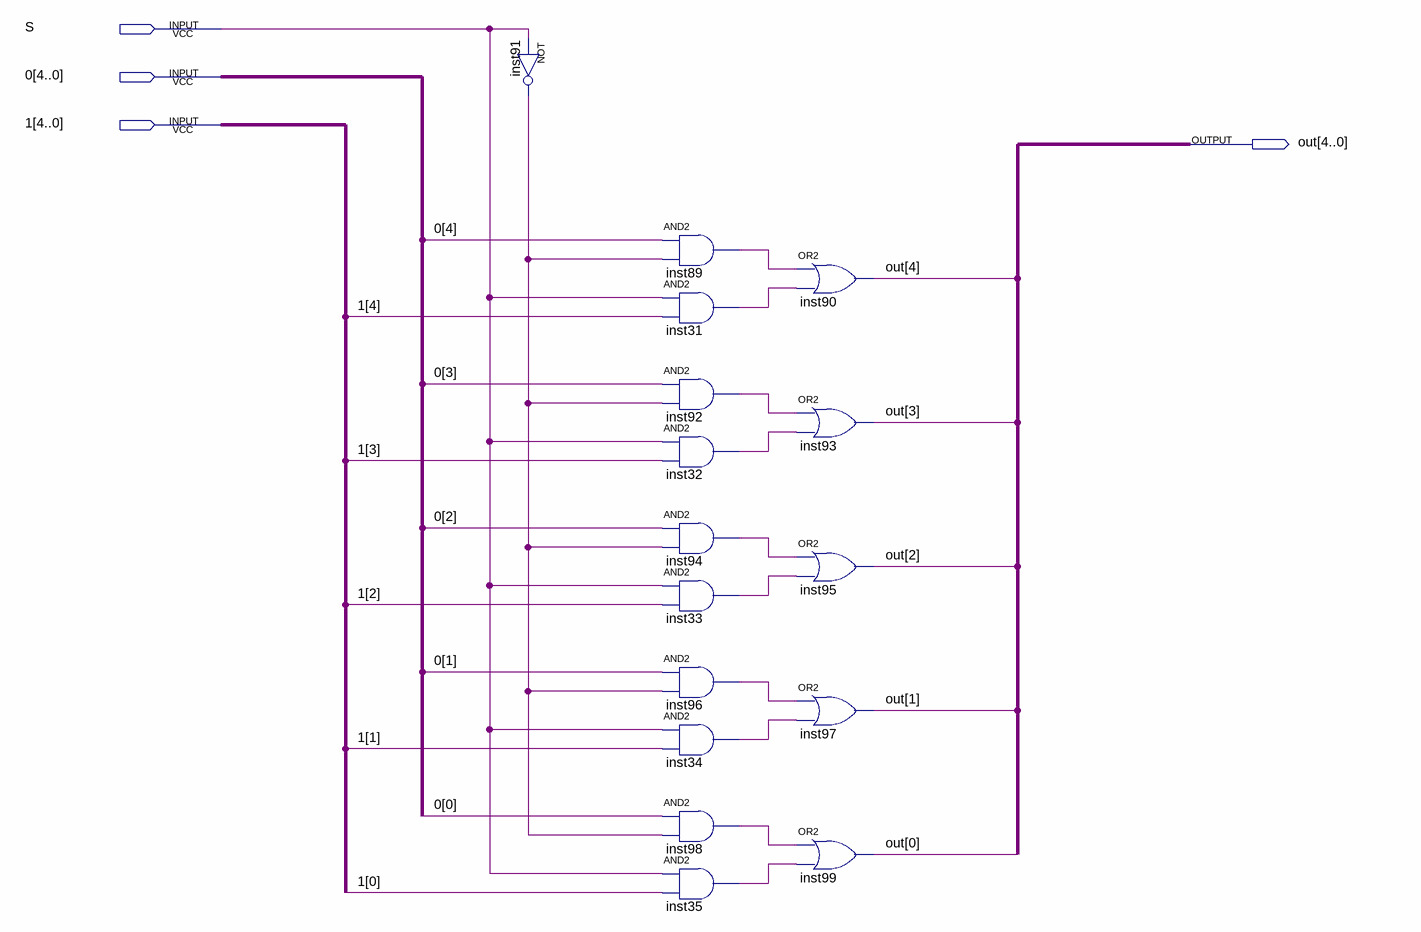
[diagram p0: schematic sheet]
// Quartus schematic Mux_2_5bits.bdf as structural Verilog: 16 symbols, 4 pins
module Mux_2_5bits (
  input  S,
  input  [4:0] \0 ,
  input  [4:0] \1 ,
  output [4:0] out
);

  wire inst31_out, inst32_out, inst33_out, inst34_out, inst35_out, inst89_out, inst91_out, inst92_out,
       inst94_out, inst96_out, inst98_out;

  not inst91 (inst91_out, S);
  and inst89 (inst89_out, \0 [4], inst91_out);
  and inst31 (inst31_out, S, \1 [4]);
  and inst92 (inst92_out, \0 [3], inst91_out);
  and inst32 (inst32_out, S, \1 [3]);
  and inst94 (inst94_out, \0 [2], inst91_out);
  and inst33 (inst33_out, S, \1 [2]);
  and inst96 (inst96_out, \0 [1], inst91_out);
  and inst34 (inst34_out, S, \1 [1]);
  and inst98 (inst98_out, \0 [0], inst91_out);
  and inst35 (inst35_out, S, \1 [0]);
  or inst90 (out[4], inst89_out, inst31_out);
  or inst93 (out[3], inst92_out, inst32_out);
  or inst95 (out[2], inst94_out, inst33_out);
  or inst97 (out[1], inst96_out, inst34_out);
  or inst99 (out[0], inst98_out, inst35_out);
endmodule
